# EAGLE design master (EAGLE 7.3.0)
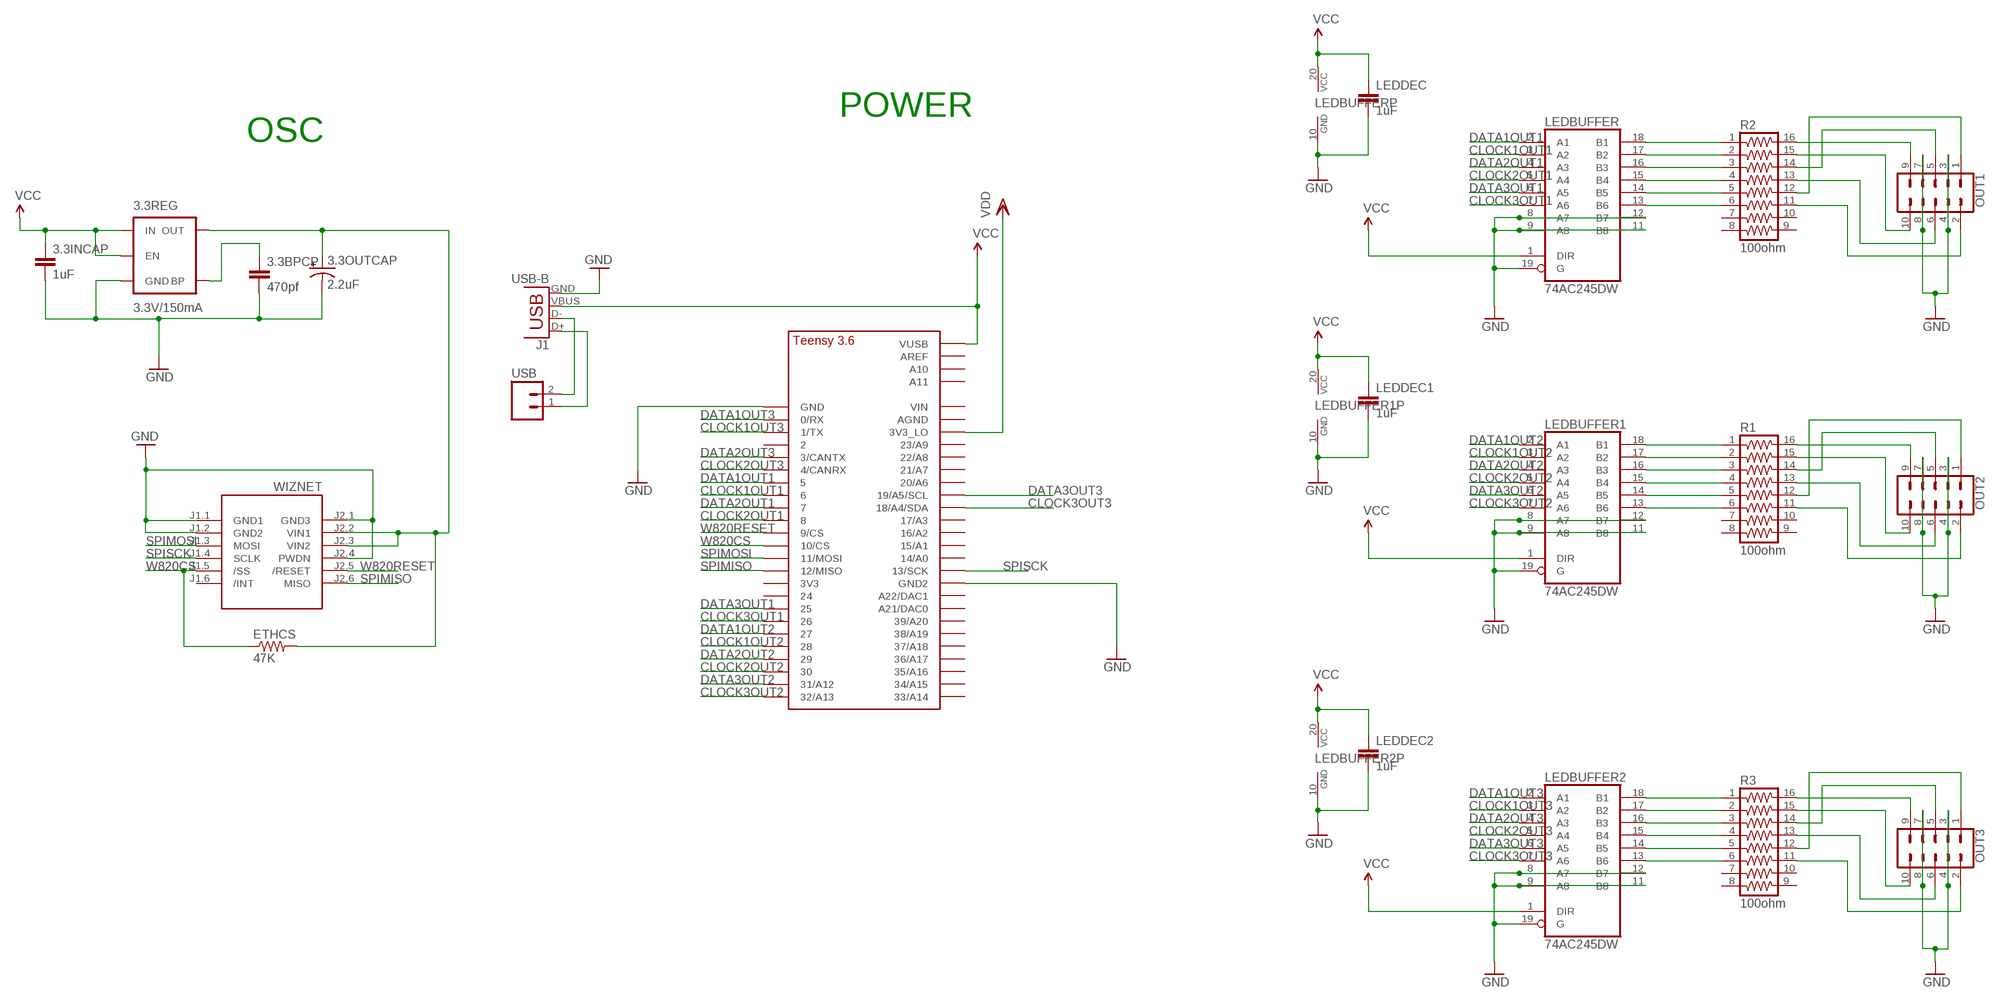
[diagram p0: schematic, sheet 1]

## Parts
3.3BPCP  470pf  CAP1206  [1206]
3.3INCAP  1uF  CAP1206  [1206]
3.3OUTCAP  2.2uF  CAP_POL3528-KIT  [EIA3528-KIT]
3.3REG  3.3V/150mA  V_REG_MIC52053.3V  [SOT23-5]
ETHCS  47K  RESISTOR1206  [1206]
J1  USB-B  USBPTH  [USB-B-PTH]
LEDBUFFER  74AC245DW  [SO20W]
LEDBUFFER1  74AC245DW  [SO20W]
LEDBUFFER2  74AC245DW  [SO20W]
LEDDEC  1uF  CAP1206  [1206]
LEDDEC1  1uF  CAP1206  [1206]
LEDDEC2  1uF  CAP1206  [1206]
OUT1  CONN_05X2SHD_LOCK  [2X5-SHROUDED_LOCK]
OUT2  CONN_05X2SHD_LOCK  [2X5-SHROUDED_LOCK]
OUT3  CONN_05X2SHD_LOCK  [2X5-SHROUDED_LOCK]
R1  100ohm  2NBS16-8  [SO16]
R2  100ohm  2NBS16-8  [SO16]
R3  100ohm  2NBS16-8  [SO16]
U$1  TEENSY_3.5/3.6_BASIC  [TEENSY_3.5/3.6_BASIC]
USB  M02LOCK_LONGPADS  [1X02_LOCK_LONGPADS]
WIZNET  WIZ820IO_DEVICE'DUAL-IN-LINE'  [WIZ820IO]

## Nets
CLOCK1OUT1: LEDBUFFER.3(A2) U$1.6
CLOCK1OUT2: LEDBUFFER1.3(A2) U$1.28
CLOCK1OUT3: LEDBUFFER2.3(A2) U$1.1/TX
CLOCK2OUT1: LEDBUFFER.5(A4) U$1.8
CLOCK2OUT2: LEDBUFFER1.5(A4) U$1.30
CLOCK2OUT3: LEDBUFFER2.5(A4) U$1.4/CANRX
CLOCK3OUT1: LEDBUFFER.7(A6) U$1.26
CLOCK3OUT2: LEDBUFFER1.7(A6) U$1.32/A13
CLOCK3OUT3: LEDBUFFER2.7(A6) U$1.18/A4/SDA
DATA1OUT1: LEDBUFFER.2(A1) U$1.5
DATA1OUT2: LEDBUFFER1.2(A1) U$1.27
DATA1OUT3: LEDBUFFER2.2(A1) U$1.0/RX
DATA2OUT1: LEDBUFFER.4(A3) U$1.7
DATA2OUT2: LEDBUFFER1.4(A3) U$1.29
DATA2OUT3: LEDBUFFER2.4(A3) U$1.3/CANTX
DATA3OUT1: LEDBUFFER.6(A5) U$1.25
DATA3OUT2: LEDBUFFER1.6(A5) U$1.31/A12
DATA3OUT3: LEDBUFFER2.6(A5) U$1.19/A5/SCL
GND: 3.3BPCP.2 3.3INCAP.2 3.3OUTCAP.C(-) 3.3REG.2(GND) J1.GND LEDBUFFER1.8(A7) LEDBUFFER1.9(A8) LEDBUFFER1.10(GND) LEDBUFFER1.11(B8) LEDBUFFER1.12(B7) LEDBUFFER1.19(G) LEDBUFFER2.8(A7) LEDBUFFER2.9(A8) LEDBUFFER2.10(GND) LEDBUFFER2.11(B8) LEDBUFFER2.12(B7) LEDBUFFER2.19(G) LEDBUFFER.8(A7) LEDBUFFER.9(A8) LEDBUFFER.10(GND) LEDBUFFER.11(B8) LEDBUFFER.12(B7) LEDBUFFER.19(G) LEDDEC1.2 LEDDEC2.2 LEDDEC.2 OUT1.3 OUT1.4 OUT1.7 OUT1.8 OUT2.3 OUT2.4 OUT2.7 OUT2.8 OUT3.3 OUT3.4 OUT3.7 OUT3.8 U$1.GND U$1.GND2 WIZNET.J1.1(GND1) WIZNET.J1.2(GND2) WIZNET.J2.1(GND3) WIZNET.J2.4(PWDN)
N$1: J1.D+ USB.1
N$2: LEDBUFFER.18(B1) R2.1
N$3: LEDBUFFER.17(B2) R2.2
N$4: LEDBUFFER.16(B3) R2.3
N$5: J1.D- USB.2
N$6: LEDBUFFER.15(B4) R2.4
N$7: LEDBUFFER.14(B5) R2.5
N$8: 3.3OUTCAP.A(+) 3.3REG.5(OUT) ETHCS.2 WIZNET.J2.2(VIN1) WIZNET.J2.3(VIN2)
N$9: OUT1.9 R2.16
N$10: OUT1.10 R2.15
N$11: OUT1.5 R2.14
N$12: OUT1.6 R2.13
N$13: OUT1.1 R2.12
N$14: OUT1.2 R2.11
N$15: LEDBUFFER1.18(B1) R1.1
N$16: LEDBUFFER1.17(B2) R1.2
N$17: LEDBUFFER.13(B6) R2.6
N$18: LEDBUFFER1.16(B3) R1.3
N$19: LEDBUFFER1.15(B4) R1.4
N$20: LEDBUFFER1.14(B5) R1.5
N$21: LEDBUFFER1.13(B6) R1.6
N$22: OUT2.9 R1.16
N$23: OUT2.10 R1.15
N$24: OUT2.5 R1.14
N$25: OUT2.6 R1.13
N$26: OUT2.1 R1.12
N$27: OUT2.2 R1.11
N$28: LEDBUFFER2.18(B1) R3.1
N$29: LEDBUFFER2.17(B2) R3.2
N$30: LEDBUFFER2.16(B3) R3.3
N$31: LEDBUFFER2.15(B4) R3.4
N$32: LEDBUFFER2.14(B5) R3.5
N$33: LEDBUFFER2.13(B6) R3.6
N$34: OUT3.9 R3.16
N$35: OUT3.10 R3.15
N$36: OUT3.5 R3.14
N$37: OUT3.6 R3.13
N$38: OUT3.1 R3.12
N$39: OUT3.2 R3.11
N$84: 3.3BPCP.1 3.3REG.4(BP)
SPIMISO: U$1.12/MISO WIZNET.J2.6(MISO)
SPIMOSI: U$1.11/MOSI WIZNET.J1.3(MOSI)
SPISCK: U$1.13/SCK WIZNET.J1.4(SCLK)
VCC: 3.3INCAP.1 3.3REG.1(IN) 3.3REG.3(EN) J1.VBUS LEDBUFFER1.1(DIR) LEDBUFFER1.20(VCC) LEDBUFFER2.1(DIR) LEDBUFFER2.20(VCC) LEDBUFFER.1(DIR) LEDBUFFER.20(VCC) LEDDEC1.1 LEDDEC2.1 LEDDEC.1 U$1.VUSB
VDD: U$1.3V3_LO
W820CS: ETHCS.1 U$1.10/CS WIZNET.J1.5(/SS)
W820RESET: U$1.9/CS WIZNET.J2.5(/RESET)
Unconnected: R1.7 R1.8 R1.9 R1.10 R2.7 R2.8 R2.9 R2.10 R3.7 R3.8 R3.9 R3.10 U$1.2 U$1.3V3 U$1.14/A0 U$1.15/A1 U$1.16/A2 U$1.17/A3 U$1.20/A6 U$1.21/A7 U$1.21/DAC0(A21/DAC0) U$1.22/A8 U$1.23/A9 U$1.24 U$1.33/A14 U$1.34/A15 U$1.35/A16 U$1.36/A17 U$1.37/A18 U$1.38/A19 U$1.39/A20 U$1.A10 U$1.A11 U$1.A22/DAC1 U$1.AGND U$1.AREF U$1.VIN WIZNET.J1.6(/INT)

## Notes on the sheet
- POWER
- OSC

## Library data of the parts
3.3BPCP 3.3INCAP LEDDEC LEDDEC1 LEDDEC2 = SparkFun-Capacitors:CAP: Capacitor Standard 0603 ceramic capacitor, and 0.1" leaded capacitor.
3.3OUTCAP = SparkFun-Passives:CAP_POL: Capacitor Polarized These are standard SMD and PTH capacitors. Normally 10uF, 47uF, and 100uF in electrolytic and tantalum varieties. Always verify the external diameter of the through hole cap, it varies with capacity, voltage, and manufacturer. The EIA devices should be standard.
3.3REG = SparkFun-PowerIC:V_REG_MIC5205: V_REG MIC5205 Standard 3.3V, 5V, and Adjustable 150mA LDO voltage regulator in SOT-23 layout. Micrel part MIC5205. BP (by-pass) pin is used to lower output noise with 470pF cap, may be left open. On the adjustable version BP is used to set output.; PROD_ID: VREG-00822
ETHCS = SparkFun-Resistors:RESISTOR: Resistor Basic schematic elements and footprints for 0603, 1206, and PTH resistors.
J1 = SparkFun-Connectors:USB: USB Connectors USB-B-PTH is fully proven SKU : PRT-00139/CONN-08278 USB-miniB is fully proven SKU : PRT-00587 USB-A-PCB is untested. USB-A-H is throughly reviewed, but untested. Spark Fun Electronics SKU : PRT-00437 USB-B-SMT is throughly reviewed, but untested. Needs silkscreen touching up. USB-A-S has not been used/tested USB-MB-H has not been used/tested USB-MICROB has been used. CONN-09505; PROD_ID: CONN-08278
LEDBUFFER LEDBUFFER1 LEDBUFFER2 = 74xx-eu:74*245: Octal BUS TRANSCEIVER, 3-state
OUT1-OUT3 = SparkFun-Connectors:CONN_05X2: Multi connection point. Often used as Generic Header-pin footprint for 0.1 inch spaced/style header connections For AVR SPI programming port, see special device with nice symbol: "AVR_SPI_PROG_5x2.dev" You can populate with any combo of single row headers, but if you'd like an exact match, check these: 2x5 AVR ICSP Male Header <https://www.sparkfun.com/products/778> (PRT-00778) 2x5 Pin Shrouded Header <https://www.sparkfun.com/products/8506> (PRT-08506) On any of the 0.1 inch spaced packages, you can populate with these: Break Away Headers - Straight <https://www.sparkfun.com/products/116> (PRT-00116) Break Away Male Headers - Right Angle <https://www.sparkfun.com/products/553> (PRT-00553) Female Headers <https://www.sparkfun.com/products/115> (PRT-00115) Break Away Headers - Machine Pin <https://www.sparkfun.com/products/117> (PRT-00117) Break Away Female Headers - Swiss Machine Pin <https://www.sparkfun.com/products/743> (PRT-00743) Special note: the shrouded connector mates well with our 5x2 ribbon cables: 2x5 Pin IDC Ribbon Cable <https://www.sparkfun.com/products/8535> (PRT-08535); PROD_ID: CONN-08671; SF_ID: PRT-08506
R1-R3 = resistor-bourns:2NBS16-8: BOURNS RESISTOR NETWORK
U$1 = Teensy356:TEENSY_3.5/3.6_BASIC
USB = SparkFun-Connectors:M02: Standard 2-pin 0.1" header. Use with - straight break away headers ( PRT-00116) - right angle break away headers (PRT-00553) - swiss pins (PRT-00743) - machine pins (PRT-00117) - female headers (PRT-00115) Molex polarized connector foot print use with: PRT-08233 with associated crimp pins and housings. 2.54_SCREWTERM for use with PRT-10571. 3.5mm Screw Terminal footprints for PRT-08084 5mm Screw Terminal footprints for use with PRT-08432
WIZNET = Wiz820io:WIZ820IO_DEVICE: WIZnet, WIZ820io plug in module incl. W5200 chip and MagJack

## Board
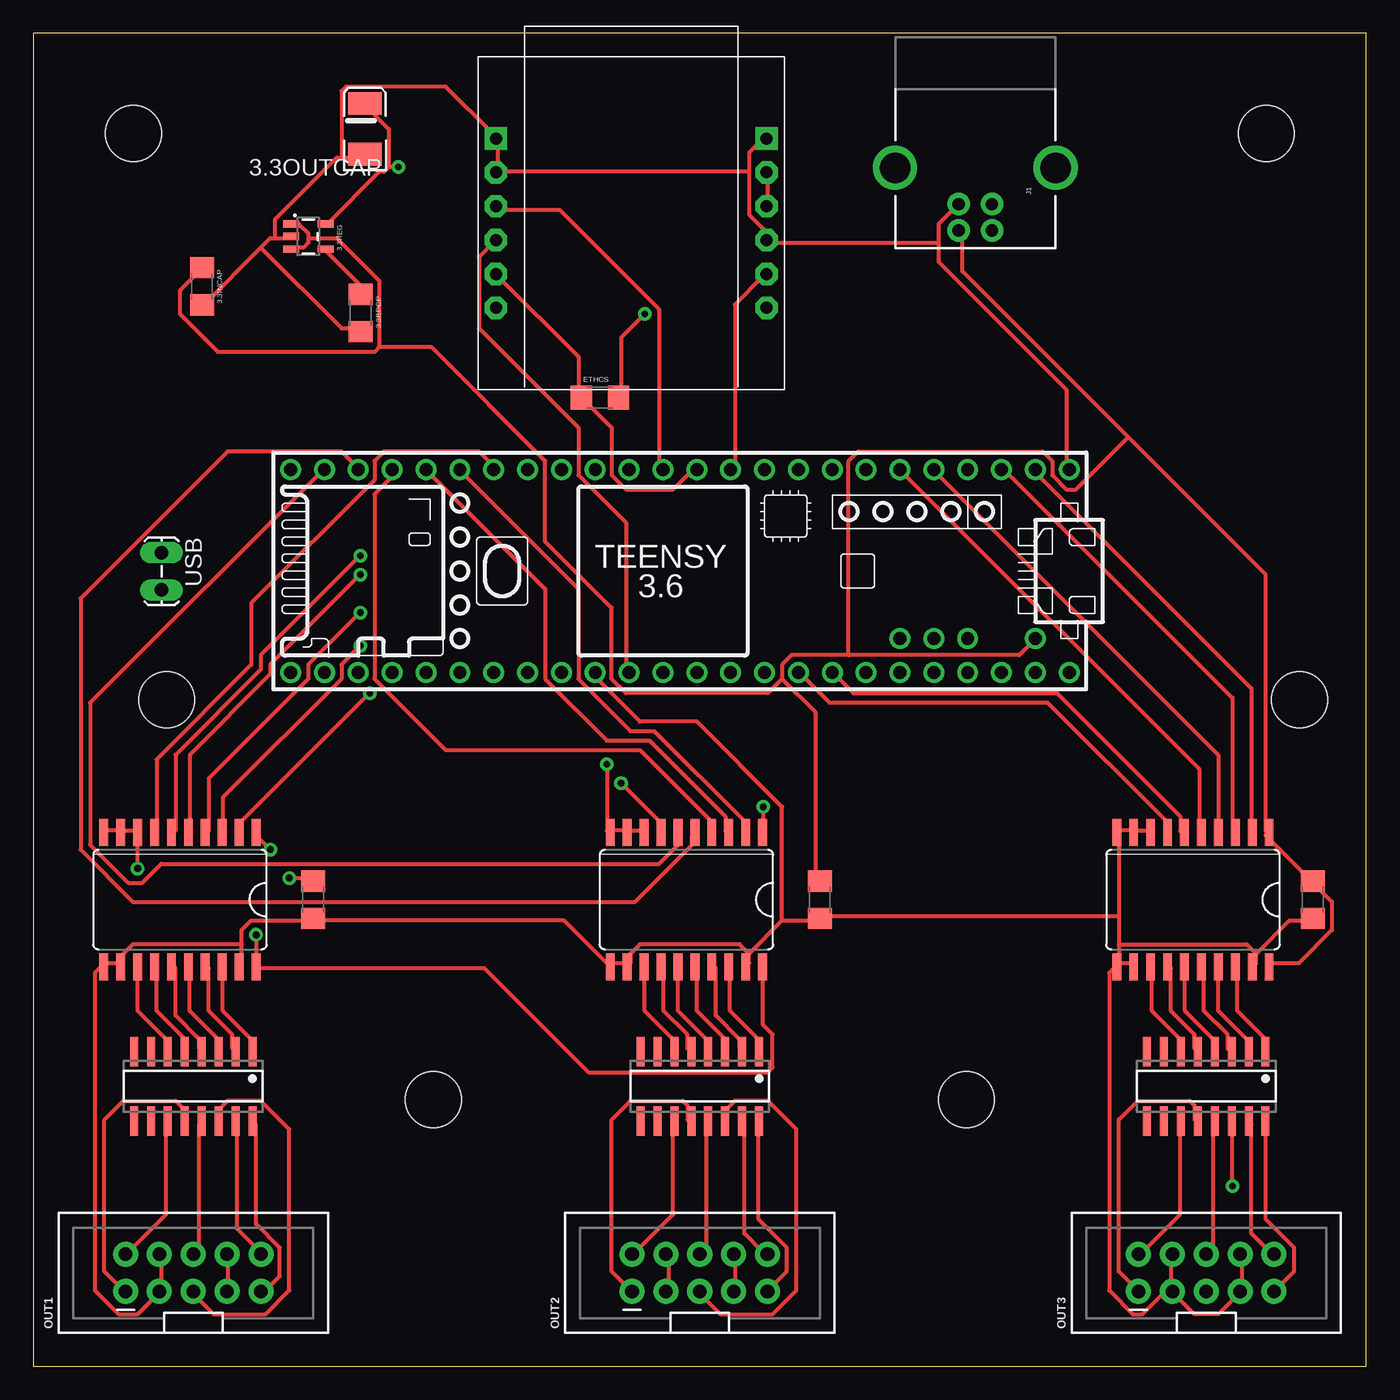
[diagram p1: board, top side]
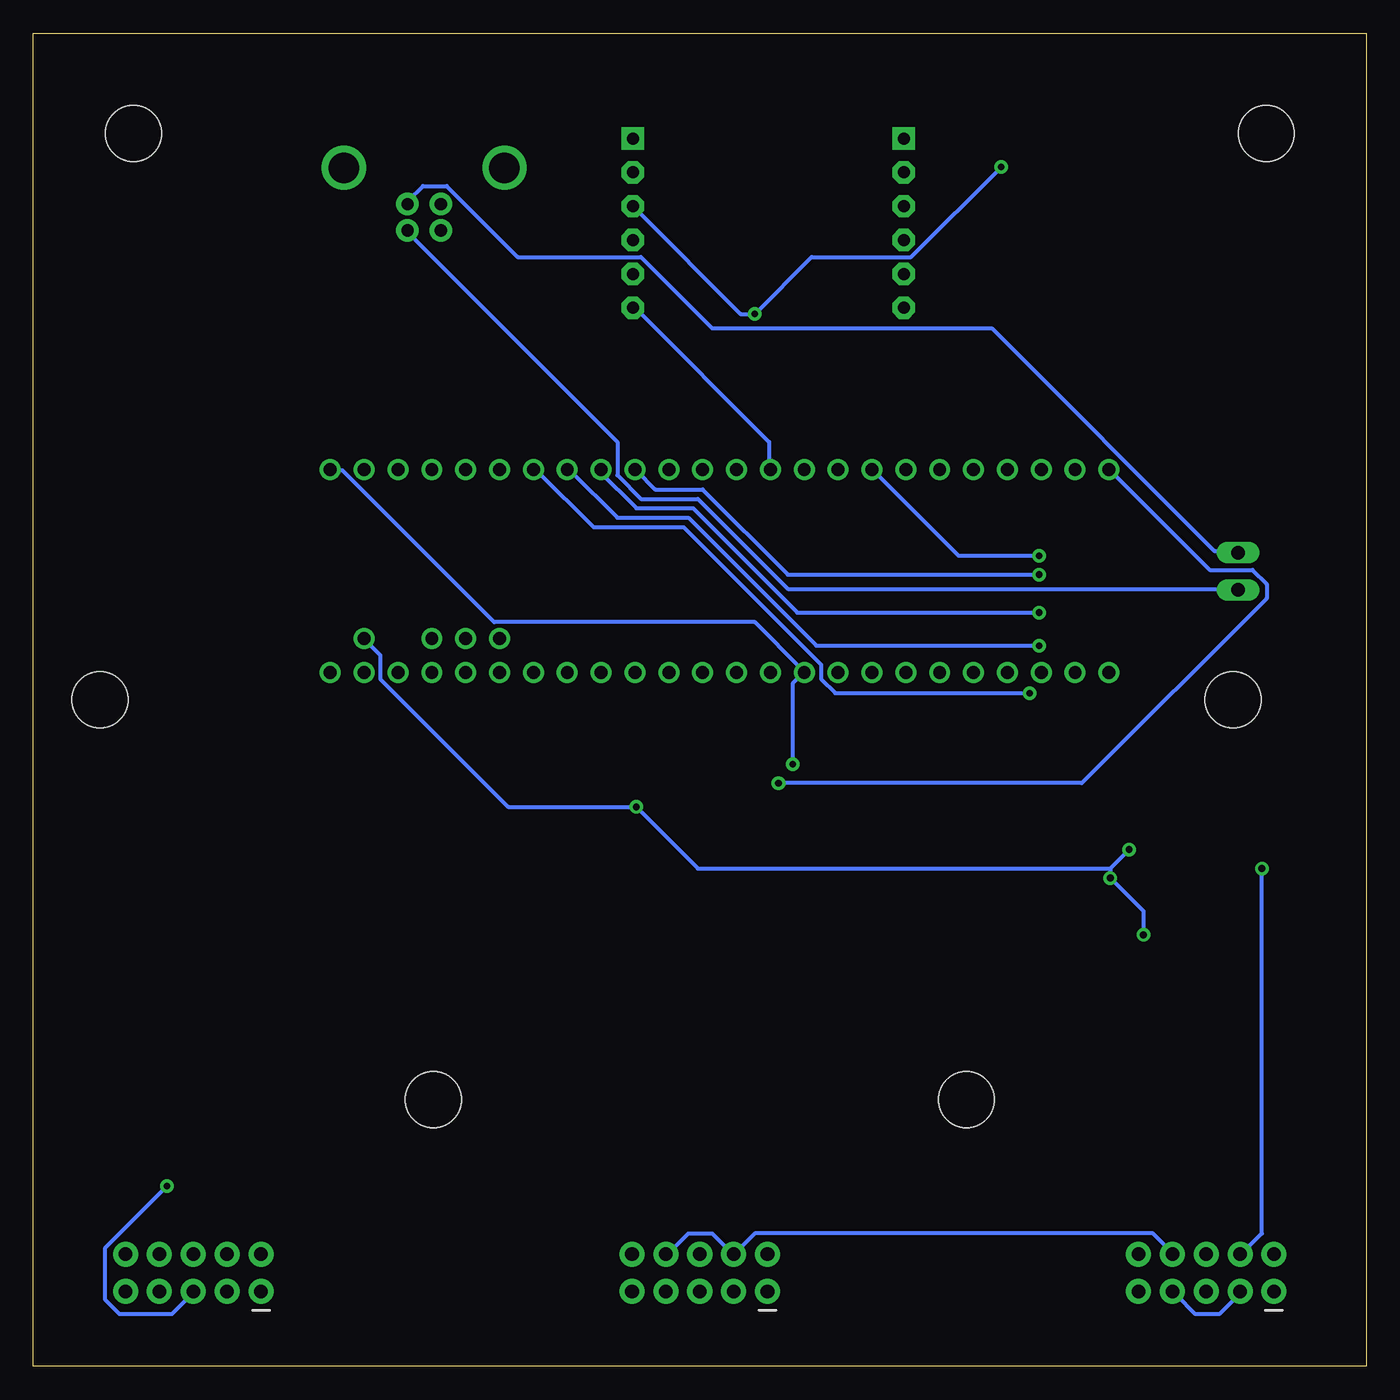
[diagram p2: board, bottom side, seen from below]

Size 100 x 100 mm. Coordinates in mm from the lower left corner, seen from the top.
Outline: 0,0 100,0 100,100 0,100 0,0
Copper layers (1*16): Top 0.035mm / dielectric 1.5mm / Bottom 0.035mm
Design rules "SparkFun *": minimum track width 12mil, minimum drill 20mil, track to track 16mil, track to pad 10mil, pad to pad 8mil, via to via 12mil, smd to smd 8mil, copper to edge 10mil, drill to drill 8mil, minimum pad ring 12mil, minimum via ring 10mil, stop-mask expansion 4mil, vias tented up to drill 25mil, thermal gap 10mil
Holes 4.2 mm at 7.5,92.5 10,50 30,20 70,20 95,50 92.5,92.5

### Footprints (pad centres in the part's own frame; a part is rotated, then mirrored left to right if it is on the bottom)
1206 = smd 1.6 x 1.8: 1 -1.4,0; 2 1.4,0
EIA3528-KIT = smd 1.7 x 2.5: A 1.9,0; C -1.9,0
SOT23-5 = smd 0.55 x 1.2: 1 -0.95,-1.3; 2 0,-1.3; 3 0.95,-1.3; 4 0.95,1.3; 5 -0.95,1.3
USB-B-PTH = drill 0.914 pad 1.676: D+ 0,1.25; D- 1.981,1.25; GND 0,-1.25; VBUS 1.981,-1.25 | drill 2.286: S1 -2.718,-6.02; S2 -2.718,6.02
SO20W = smd 0.66 x 2.032: 1 -5.715,-5.029; 2 -4.445,-5.029; 3 -3.175,-5.029; 4 -1.905,-5.029; 5 -0.635,-5.029; 6 0.635,-5.029; 7 1.905,-5.029; 8 3.175,-5.029; 9 4.445,-5.029; 10 5.715,-5.029; 11 5.715,5.029; 12 4.445,5.029; 13 3.175,5.029; 14 1.905,5.029; 15 0.635,5.029; 16 -0.635,5.029; 17 -1.905,5.029; 18 -3.175,5.029; 19 -4.445,5.029; 20 -5.715,5.029
2X5-SHROUDED_LOCK = drill 1.016 pad 1.88: 1 -1.397,5.08; 2 1.397,5.08; 3 -1.397,2.54; 4 1.397,2.54; 5 -1.397,0; 6 1.397,0; 7 -1.397,-2.54; 8 1.397,-2.54; 9 -1.397,-5.08; 10 1.397,-5.08
SO16 = smd 0.6 x 2.2: 1 -4.445,-2.6; 2 -3.175,-2.6; 3 -1.905,-2.6; 4 -0.635,-2.6; 5 0.635,-2.6; 6 1.905,-2.6; 7 3.175,-2.6; 8 4.445,-2.6; 9 4.445,2.6; 10 3.175,2.6; 11 1.905,2.6; 12 0.635,2.6; 13 -0.635,2.6; 14 -1.905,2.6; 15 -3.175,2.6; 16 -4.445,2.6
TEENSY_3.5/3.6_BASIC = drill 0.965: 0/RX -25.4,-7.62; 1/TX -22.86,-7.62; 2 -20.32,-7.62; 3/CANTX -17.78,-7.62; 3V3 7.62,-7.62; 3V3_LO -22.86,7.62; 4/CANRX -15.24,-7.62; 5 -12.7,-7.62; 6 -10.16,-7.62; 7 -7.62,-7.62; 8 -5.08,-7.62; 9/CS -2.54,-7.62; 10/CS 0,-7.62; 11/MOSI 2.54,-7.62; 12/MISO 5.08,-7.62; 13/SCK 5.08,7.62; 14/A0 2.54,7.62; 15/A1 0,7.62; 16/A2 -2.54,7.62; 17/A3 -5.08,7.62; 18/A4/SDA -7.62,7.62; 19/A5/SCL -10.16,7.62; 20/A6 -12.7,7.62; 21/A7 -15.24,7.62; 21/DAC0 12.7,7.62; 22/A8 -17.78,7.62; 23/A9 -20.32,7.62; 24 10.16,-7.62; 25 12.7,-7.62; 26 15.24,-7.62; 27 17.78,-7.62; 28 20.32,-7.62; 29 22.86,-7.62; 30 25.4,-7.62; 31/A12 27.94,-7.62; 32/A13 30.48,-7.62; 33/A14 30.48,7.62; 34/A15 27.94,7.62; 35/A16 25.4,7.62; 36/A17 22.86,7.62; 37/A18 20.32,7.62; 38/A19 17.78,7.62; 39/A20 15.24,7.62; A10 -17.78,5.08; A11 -15.24,5.08; A22/DAC1 10.16,7.62; AGND -25.4,7.62; AREF -20.32,5.08; GND -27.94,-7.62; GND2 7.62,7.62; VIN -27.94,7.62; VUSB -25.4,5.08
1X02_LOCK_LONGPADS = drill 1.016 long: 1 -0.127,0; 2 2.667,0
WIZ820IO = drill 0.9 pad 1.676 square: J1.1 -10.16,6.35; J2.1 10.16,6.35 | drill 0.9 pad 1.676 octagon: J1.2 -10.16,3.81; J1.3 -10.16,1.27; J1.4 -10.16,-1.27; J1.5 -10.16,-3.81; J1.6 -10.16,-6.35; J2.2 10.16,3.81; J2.3 10.16,1.27; J2.4 10.16,-1.27; J2.5 10.16,-3.81; J2.6 10.16,-6.35

### Placement (x,y rotation side)
3.3BPCP  24.57,79.02 270 top
3.3INCAP  12.65,81.02 270 top
3.3OUTCAP  24.88,92.83 90 top
3.3REG  20.63,84.75 270 top
ETHCS  42.5,72.67 0 top
J1  70.68,87.19 270 top
LEDBUFFER  11,35 180 top
LEDBUFFER1  49,35 180 top
LEDBUFFER2  87,35 180 top
LEDDEC  21,35 270 top
LEDDEC1  59,35 270 top
LEDDEC2  96,35 270 top
OUT1  12,7 90 top
OUT2  50,7 90 top
OUT3  88,7 90 top
R1  50,21 180 top
R2  12,21 180 top
R3  88,21 180 top
U$1  49.78,59.66 180 top
USB  9.62,60.91 270 top
WIZNET  44.86,85.76 0 top

### Tracks (layer width: path | path; a pad name or v marks a point on that pad's centre or on a via)
CLOCK1OUT1  (via drill 0.51)
  Top 0.305: v24.54,54.05 23.11,52.63 23.11,51.56 14.22,42.67 14.22,40.18 LEDBUFFER.3
  Bottom 0.305: v24.54,54.05 41.25,54.05 50.85,63.65 56.19,63.65 59.74,67.21 U$1.6
CLOCK1OUT2
  Top 0.305: LEDBUFFER1.3 51.92,40.18 51.92,41.25 46.23,46.94 43.03,46.94 38.41,51.56 38.41,58.32 29.52,67.21 U$1.28
CLOCK1OUT3
  Top 0.305: LEDBUFFER2.3 89.97,40.18 89.97,50.14 72.9,67.21 U$1.1/TX
CLOCK2OUT1  (via drill 0.51)
  Top 0.305: v24.54,59.38 17.78,52.63 17.78,51.92 11.73,45.87 11.73,40.18 LEDBUFFER.5
  Bottom 0.305: v24.54,59.38 43.38,59.38 49.78,65.79 53.34,65.79 54.76,67.21 U$1.8
CLOCK2OUT2
  Top 0.305: LEDBUFFER1.5 49.43,39.83 49.43,39.12 45.16,34.85 7.47,34.85 3.56,38.76 3.56,57.61 14.58,68.63 23.11,68.63 24.18,67.56 U$1.30
CLOCK2OUT3
  Top 0.305: LEDBUFFER2.5 87.48,40.18 87.48,44.81 65.08,67.21 U$1.4/CANRX
CLOCK3OUT1
  Top 0.305: LEDBUFFER.7 9.25,40.18 9.25,45.52 16.36,52.63 16.36,57.25 25.6,66.5 25.6,67.92 26.31,68.63 33.43,68.63 34.49,67.56 U$1.26
CLOCK3OUT2  (via drill 0.51)
  Top 0.305: v44.09,43.74 46.94,40.89 46.94,40.18 LEDBUFFER1.7
  Bottom 0.305: v44.09,43.74 21.34,43.74 7.47,57.61 7.47,58.67 8.53,59.74 11.73,59.74 19.2,67.21 U$1.32/A13
CLOCK3OUT3
  Top 0.305: LEDBUFFER2.7 84.99,40.18 84.99,40.89 76.1,49.78 59.74,49.78 57.61,51.92 U$1.18/A4/SDA
DATA1OUT1  (via drill 0.51)
  Top 0.305: v25.25,50.49 15.65,40.89 15.65,40.18 LEDBUFFER.2
  Bottom 0.305: v25.25,50.49 39.83,50.49 40.89,51.56 40.89,52.63 51.21,62.94 57.96,62.94 62.23,67.21 U$1.5
DATA1OUT2
  Top 0.305: LEDBUFFER1.2 53.34,40.18 53.34,40.89 46.58,47.65 44.81,47.65 40.89,51.56 40.89,58.32 32,67.21 U$1.27
DATA1OUT3
  Top 0.305: LEDBUFFER2.2 91.39,40.18 91.39,50.85 75.03,67.21 U$1.0/RX
DATA2OUT1  (via drill 0.51)
  Top 0.305: v24.54,56.54 20.62,52.63 20.62,51.56 13.16,44.09 13.16,40.18 LEDBUFFER.4
  Bottom 0.305: v24.54,56.54 42.67,56.54 50.49,64.36 54.76,64.36 57.61,67.21 U$1.7
DATA2OUT2
  Top 0.305: LEDBUFFER1.4 50.85,40.18 50.85,40.89 45.52,46.23 30.94,46.23 25.6,51.56 25.6,65.43 26.67,66.5 26.67,67.21 U$1.29
DATA2OUT3
  Top 0.305: LEDBUFFER2.4 88.9,40.18 88.9,45.87 67.56,67.21 U$1.3/CANTX
DATA3OUT1  (via drill 0.51)
  Top 0.305: v24.54,60.81 17.07,53.34 17.07,52.27 10.67,45.87 10.67,40.18 LEDBUFFER.6
  Bottom 0.305: v24.54,60.81 30.58,60.81 36.98,67.21 U$1.25
DATA3OUT2
  Top 0.305: LEDBUFFER1.6 48.36,39.83 48.36,39.12 46.94,37.69 9.6,37.69 8.18,36.27 7.11,36.27 4.27,39.12 4.27,49.78 21.69,67.21 U$1.31/A12
DATA3OUT3
  Top 0.305: LEDBUFFER2.6 86.06,40.18 86.06,41.25 76.81,50.49 61.52,50.49 60.1,51.92 U$1.19/A5/SCL
GND  (via drill 0.51)
  Top 0.305: 67.92,84.28 67.92,85.7 69.34,87.12 J1.GND | 67.92,84.28 67.92,82.86 77.52,73.25 77.52,67.56 U$1.GND | 18.14,84.63 17.78,84.63 17.07,83.92 | 18.14,84.63 19.2,84.63 3.3REG.2 | 17.07,83.92 12.8,79.65 3.3INCAP.2 | 17.07,83.92 23.11,77.88 24.54,77.88 3.3BPCP.2 | 23.11,90.68 22.76,90.68 18.14,86.06 18.14,84.63 | 23.11,90.68 24.54,90.68 3.3OUTCAP.C | 34.85,89.61 34.85,92.1 WIZNET.J1.1 34.49,92.46 30.94,96.01 23.47,96.01 23.11,95.66 23.11,90.68 | 53.7,89.61 53.7,91.03 54.76,92.1 WIZNET.J2.1 | 53.7,89.61 53.7,86.41 54.76,85.34 54.76,84.63 WIZNET.J2.4 55.12,84.28 67.92,84.28 | 53.7,89.61 34.85,89.61 | 34.85,89.61 WIZNET.J1.2 | OUT2.3 47.65,5.69 47.65,8.18 OUT2.4 | OUT2.7 52.63,5.69 52.63,8.18 OUT2.8 | OUT1.7 14.58,5.69 14.58,8.18 OUT1.8 | LEDBUFFER.10 5.33,40.18 6.4,40.18 LEDBUFFER.9 6.76,40.18 7.82,40.18 LEDBUFFER.8 7.82,39.83 v7.82,37.34 | OUT1.4 9.6,8.18 9.6,5.69 OUT1.3 9.25,5.33 7.82,3.91 6.4,3.91 4.62,5.69 4.62,29.52 4.98,29.87 LEDBUFFER.11 5.33,30.23 6.4,30.23 LEDBUFFER.12 6.76,30.23 6.76,30.94 7.47,31.65 15.65,31.65 | OUT3.3 85.34,5.69 85.34,8.18 OUT3.4 | OUT3.8 90.68,8.18 90.68,5.69 OUT3.7 90.32,5.33 88.9,3.91 87.12,3.91 85.7,5.33 OUT3.3 | 91.75,30.94 94.23,33.43 95.66,33.43 LEDDEC2.2 | 91.75,30.94 91.75,30.23 LEDBUFFER2.19 91.75,30.94 | 81.43,30.23 82.5,30.23 LEDBUFFER2.12 | LEDBUFFER2.8 83.57,40.18 82.86,40.18 LEDBUFFER2.9 82.5,40.18 81.43,40.18 LEDBUFFER2.10 81.43,39.83 81.43,33.78 | 81.43,33.78 81.43,31.65 | 81.43,31.65 81.43,30.23 | 81.43,30.23 LEDBUFFER2.11 81.08,29.87 80.72,29.52 80.72,5.69 82.5,3.91 83.21,3.91 84.63,5.33 85.34,5.33 OUT3.3 | 91.75,30.94 91.03,31.65 81.43,31.65
  Top 0.305: 15.65,31.65 15.65,30.23 LEDBUFFER.19 | 15.65,31.65 15.65,32.72 16.36,33.43 20.98,33.43 LEDDEC.2 21.34,33.43 39.83,33.43 43.03,30.23 LEDBUFFER1.11 43.38,30.23 44.45,30.23 LEDBUFFER1.12 44.81,30.23 44.81,30.94 45.52,31.65 52.98,31.65 53.7,30.94 | LEDBUFFER1.8 45.52,40.18 44.81,40.18 LEDBUFFER1.9 44.45,40.18 43.38,40.18 LEDBUFFER1.10 43.03,40.18 v43.03,45.16 | 56.19,33.43 58.67,33.43 LEDDEC1.2 59.03,33.78 81.43,33.78 | 53.7,30.94 56.19,33.43 | 53.7,30.94 53.7,30.23 LEDBUFFER1.19 53.7,30.94 | 56.19,33.43 56.19,41.96 49.78,48.36 45.52,48.36 42.32,51.56 42.32,51.92 U$1.GND2
  Bottom 0.305: OUT2.8 52.27,8.53 50.85,9.96 49.07,9.96 47.65,8.53 OUT2.4 47.3,8.53 45.87,9.96 16,9.96 14.58,8.53 OUT1.8 | v7.82,37.34 7.82,9.96 9.25,8.53 OUT1.4 | OUT1.7 14.22,5.33 12.8,3.91 11.02,3.91 9.6,5.33 OUT1.3 | v43.03,45.16 43.03,51.21 42.32,51.92 U$1.GND2 42.32,52.27 45.87,55.83 65.43,55.83 76.81,67.21 77.52,67.21 U$1.GND
N$1
  Bottom 0.305: USB.1 9.96,61.16 11.38,61.16 28.09,77.88 49.07,77.88 54.41,83.21 63.65,83.21 68.99,88.54 70.76,88.54 71.83,87.48 J1.D+
N$2
  Top 0.305: LEDBUFFER.18 14.22,29.87 14.22,26.67 16.36,24.54 16.36,23.82 R2.1
N$3
  Top 0.305: LEDBUFFER.17 13.16,29.87 13.16,26.67 14.94,24.89 14.94,23.82 R2.2
N$4
  Top 0.305: LEDBUFFER.16 11.73,29.87 11.73,26.67 13.87,24.54 13.87,23.82 R2.3
N$5
  Bottom 0.305: USB.2 9.96,58.32 43.38,58.32 50.14,65.08 54.41,65.08 56.19,66.85 56.19,69.34 71.83,84.99 J1.D-
N$6
  Top 0.305: LEDBUFFER.15 10.67,29.87 10.67,26.31 12.45,24.54 12.45,23.82 R2.4
N$7
  Top 0.305: LEDBUFFER.14 9.25,29.87 9.25,26.67 11.38,24.54 11.38,23.82 R2.5
N$8  (via drill 0.51)
  Top 0.305: 26.67,89.97 26.31,89.61 25.96,89.61 22.05,85.7 3.3REG.5 | 26.67,89.97 26.67,92.81 24.89,94.59 3.3OUTCAP.A | v45.87,78.94 44.09,77.17 44.09,72.9 ETHCS.2 | WIZNET.J2.2 55.12,89.26 55.12,87.12 WIZNET.J2.3 | v27.38,89.97 26.67,89.97
  Bottom 0.305: WIZNET.J2.3 54.76,86.77 46.94,78.94 v45.87,78.94 41.6,83.21 34.14,83.21 v27.38,89.97
N$9
  Top 0.305: R2.16 16.71,18.14 16.71,10.67 18.49,8.89 18.49,6.76 17.42,5.69 OUT1.9
N$10
  Top 0.305: R2.15 15.29,18.14 15.29,10.31 17.07,8.53 OUT1.10
N$11
  Top 0.305: R2.14 13.87,18.49 13.87,19.2 14.58,19.91 17.07,19.91 19.2,17.78 19.2,5.69 17.42,3.91 13.51,3.91 12.09,5.33 OUT1.5
N$12
  Top 0.305: R2.13 12.45,18.14 12.45,8.89 12.09,8.53 OUT1.6
N$13
  Top 0.305: R2.12 11.38,18.49 11.38,19.2 10.67,19.91 6.76,19.91 5.33,18.49 5.33,7.11 6.76,5.69 OUT1.1
N$14
  Top 0.305: R2.11 9.96,18.14 9.96,11.38 7.11,8.53 OUT1.2
N$15
  Top 0.305: LEDBUFFER1.18 52.27,29.87 52.27,26.67 54.41,24.54 54.41,23.82 R1.1
N$16
  Top 0.305: LEDBUFFER1.17 51.21,29.87 51.21,26.31 52.98,24.54 52.98,23.82 R1.2
N$17
  Top 0.305: LEDBUFFER.13 7.82,29.87 7.82,26.67 9.96,24.54 9.96,23.82 R2.6
N$18
  Top 0.305: LEDBUFFER1.16 49.78,29.87 49.78,26.67 51.92,24.54 51.92,23.82 R1.3
N$19
  Top 0.305: LEDBUFFER1.15 48.36,29.87 48.36,26.67 50.49,24.54 50.49,23.82 R1.4
N$20
  Top 0.305: LEDBUFFER1.14 47.3,29.87 47.3,26.67 49.07,24.89 49.07,23.82 R1.5
N$21
  Top 0.305: LEDBUFFER1.13 45.87,29.87 45.87,26.67 48.01,24.54 48.01,23.82 R1.6
N$22
  Top 0.305: R1.16 54.41,18.14 54.41,11.02 56.54,8.89 56.54,7.11 55.12,5.69 OUT2.9
N$23
  Top 0.305: R1.15 53.34,18.14 53.34,9.96 54.76,8.53 OUT2.10
N$24
  Top 0.305: R1.14 51.92,18.49 51.92,19.2 52.63,19.91 55.12,19.91 57.25,17.78 57.25,5.69 55.47,3.91 51.56,3.91 50.14,5.33 OUT2.5
N$25
  Top 0.305: R1.13 50.49,18.14 50.49,8.89 50.14,8.53 OUT2.6
N$26
  Top 0.305: R1.12 49.07,18.49 49.07,19.56 48.72,19.91 44.81,19.91 43.38,18.49 43.38,7.11 44.81,5.69 OUT2.1
N$27
  Top 0.305: R1.11 48.01,18.14 48.01,11.38 45.16,8.53 OUT2.2
N$28
  Top 0.305: LEDBUFFER2.18 90.32,29.87 90.32,26.67 92.46,24.54 92.46,23.82 R3.1
N$29
  Top 0.305: LEDBUFFER2.17 88.9,29.87 88.9,26.67 91.03,24.54 91.03,23.82 R3.2
N$30
  Top 0.305: LEDBUFFER2.16 87.83,29.87 87.83,26.67 89.61,24.89 89.61,23.82 R3.3
N$31
  Top 0.305: LEDBUFFER2.15 86.41,29.87 86.41,26.67 88.54,24.54 88.54,23.82 R3.4
N$32
  Top 0.305: LEDBUFFER2.14 85.34,29.87 85.34,26.67 87.12,24.89 87.12,23.82 R3.5
N$33
  Top 0.305: LEDBUFFER2.13 83.92,29.87 83.92,26.67 86.06,24.54 86.06,23.82 R3.6
N$34
  Top 0.305: R3.16 92.46,18.14 92.46,11.02 94.59,8.89 94.59,7.11 93.17,5.69 OUT3.9
N$35
  Top 0.305: R3.15 91.39,18.14 91.39,9.96 92.81,8.53 OUT3.10
N$36  (via drill 0.51)
  Top 0.305: v89.97,13.51 89.97,18.14 R3.14
  Bottom 0.305: v89.97,13.51 94.59,8.89 94.59,4.98 93.52,3.91 89.61,3.91 88.19,5.33 OUT3.5
N$37
  Top 0.305: R3.13 88.54,18.14 88.54,8.89 88.19,8.53 OUT3.6
N$38
  Top 0.305: R3.12 87.12,18.49 87.12,19.56 86.77,19.91 82.86,19.91 81.43,18.49 81.43,7.11 82.86,5.69 OUT3.1
N$39
  Top 0.305: R3.11 86.06,18.14 86.06,11.38 83.21,8.53 OUT3.2
N$84
  Top 0.305: 3.3REG.4 22.05,83.57 24.89,80.72 3.3BPCP.1
SPIMISO
  Bottom 0.305: U$1.12/MISO 44.81,67.56 44.81,69.34 54.76,79.3 WIZNET.J2.6
SPIMOSI
  Top 0.305: U$1.11/MOSI 46.94,67.56 46.94,79.3 39.47,86.77 34.85,86.77 WIZNET.J1.3
SPISCK
  Top 0.305: U$1.13/SCK 44.45,52.27 44.45,63.3 40.89,66.85 40.89,70.41 33.43,77.88 33.43,83.21 34.49,84.28 WIZNET.J1.4
VCC  (via drill 0.51)
  Top 0.305: LEDBUFFER2.20 92.81,30.23 94.94,30.23 97.43,32.72 97.43,34.85 96.01,36.27 LEDDEC2.1 95.66,36.63 92.46,39.83 LEDBUFFER2.1 92.46,40.18 92.46,59.38 82.14,69.7 | 82.14,69.7 69.7,82.14 69.7,84.99 J1.VBUS | v19.2,36.63 20.98,36.63 LEDDEC.1 | v17.78,38.76 16.71,39.83 LEDBUFFER.1 | v16.71,32.36 16.71,30.23 LEDBUFFER.20 16.71,29.87 33.83,29.87 41.65,22.05 55.12,22.05 55.47,22.4 55.47,24.89 54.76,25.6 54.76,29.87 LEDBUFFER1.20 | 20.62,84.63 20.62,84.99 19.91,85.7 19.56,85.7 3.3REG.1 | 20.62,84.63 20.62,84.28 20.27,83.92 19.56,83.92 3.3REG.3 | 25.96,76.45 25.6,76.1 13.87,76.1 11.02,78.94 11.02,80.72 12.45,82.14 3.3INCAP.1 | 25.96,76.45 25.96,81.43 22.76,84.63 20.62,84.63 | 56.19,51.56 58.67,49.07 58.67,36.63 LEDDEC1.1 | 56.19,51.56 56.19,52.63 56.9,53.34 61.16,53.34 | 61.16,53.34 73.97,53.34 75.03,54.41 U$1.VUSB | v54.76,41.96 54.76,40.18 LEDBUFFER1.1 | 25.96,76.45 29.87,76.45 38.41,67.92 38.41,61.87 43.38,56.9 43.38,51.56 44.45,50.49 55.12,50.49 56.19,51.56 | 82.14,69.7 78.23,65.79 77.52,65.79 76.45,66.85 76.45,67.92 75.74,68.63 61.87,68.63 61.16,67.92 61.16,53.34
  Bottom 0.305: 19.2,37.34 v19.2,36.63 16.71,34.14 v16.71,32.36 | v17.78,38.76 19.2,37.34 | U$1.VUSB 75.03,54.41 73.97,53.34 73.97,51.56 64.36,41.96 v54.76,41.96 50.14,37.34 19.2,37.34
W820CS
  Top 0.305: WIZNET.J1.5 34.85,81.79 40.89,75.74 40.89,72.9 ETHCS.1 41.25,72.54 43.38,70.41 43.38,66.85 44.45,65.79 48.01,65.79 49.43,67.21 U$1.10/CS
W820RESET
  Top 0.305: U$1.9/CS 52.63,67.56 52.63,79.65 54.76,81.79 WIZNET.J2.5